# Altium schematic sheet AD7799.SchDoc
size A4; SheetNumber: 2; SheetTotal: 6
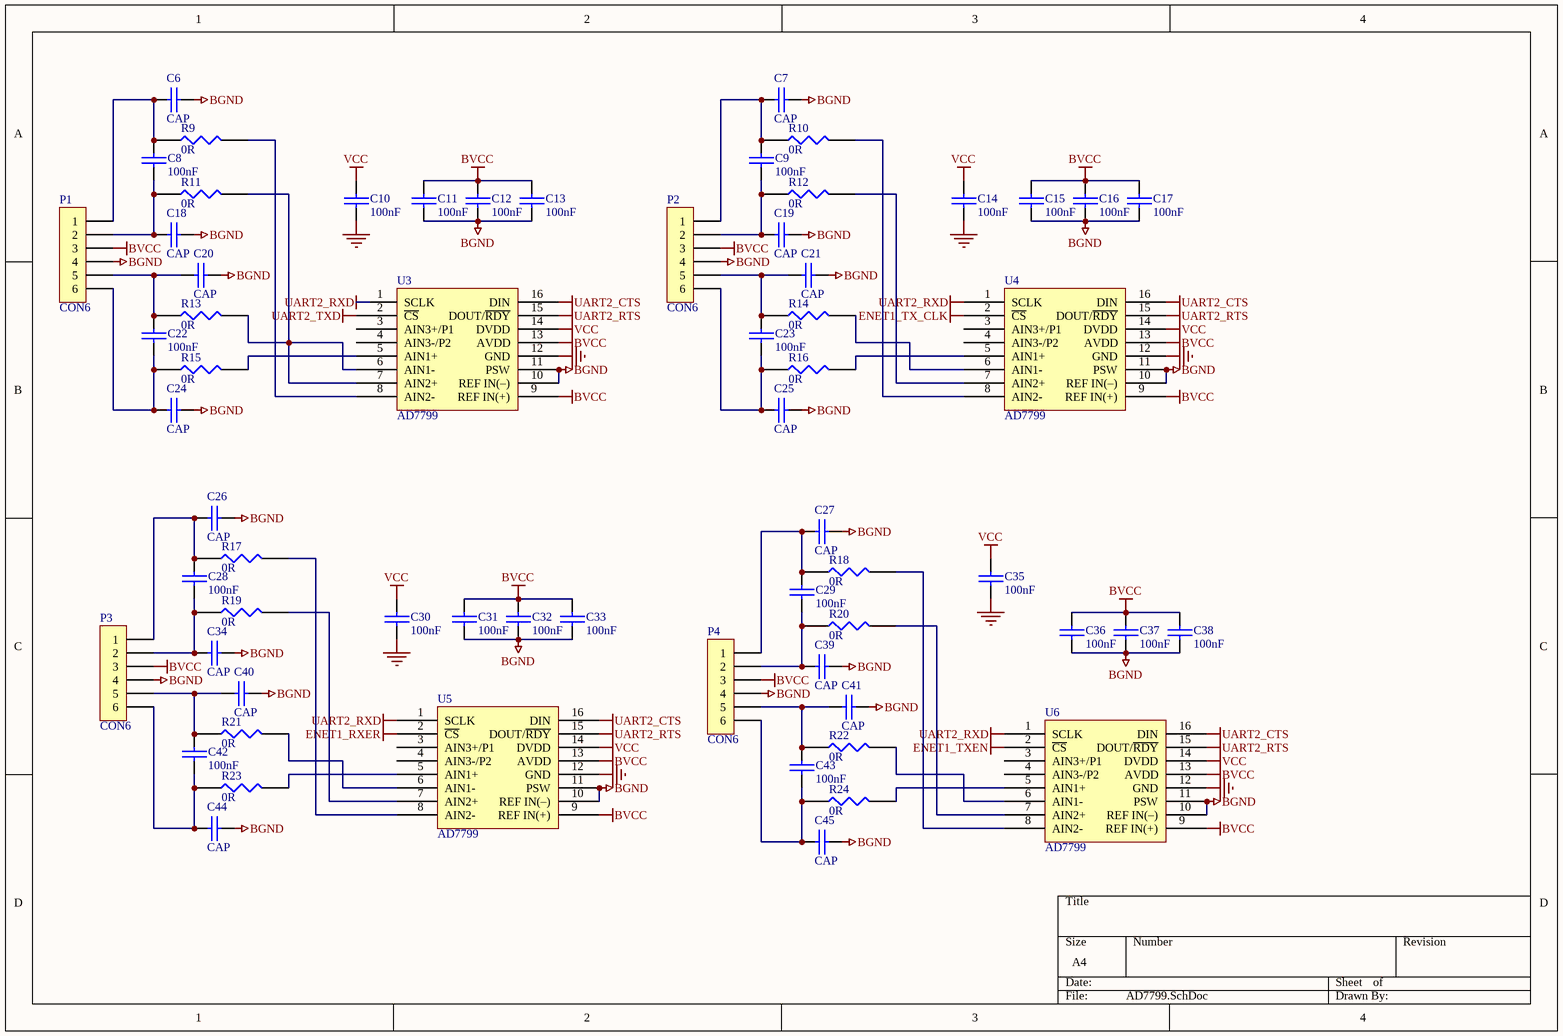
[diagram p0: AD7799.SchDoc]

## Parts
C6  CAP  [0603_C]
C7  CAP  [0603_C]
C8  100nF  [0603_C]
C9  100nF  [0603_C]
C10  100nF  [0603_C]
C11  100nF  [0603_C]
C12  100nF  [0603_C]
C13  100nF  [0603_C]
C14  100nF  [0603_C]
C15  100nF  [0603_C]
C16  100nF  [0603_C]
C17  100nF  [0603_C]
C18  CAP  [0603_C]
C19  CAP  [0603_C]
C20  CAP  [0603_C]
C21  CAP  [0603_C]
C22  100nF  [0603_C]
C23  100nF  [0603_C]
C24  CAP  [0603_C]
C25  CAP  [0603_C]
C26  CAP  [0603_C]
C27  CAP  [0603_C]
C28  100nF  [0603_C]
C29  100nF  [0603_C]
C30  100nF  [0603_C]
C31  100nF  [0603_C]
C32  100nF  [0603_C]
C33  100nF  [0603_C]
C34  CAP  [0603_C]
C35  100nF  [0603_C]
C36  100nF  [0603_C]
C37  100nF  [0603_C]
C38  100nF  [0603_C]
C39  CAP  [0603_C]
C40  CAP  [0603_C]
C41  CAP  [0603_C]
C42  100nF  [0603_C]
C43  100nF  [0603_C]
C44  CAP  [0603_C]
C45  CAP  [0603_C]
P1  CON6  [KF128-3.81-6P]
P2  CON6  [KF128-3.81-6P]
P3  CON6  [KF128-3.81-6P]
P4  CON6  [KF128-3.81-6P]
R9  0R  [0603_R]
R10  0R  [0603_R]
R11  0R  [0603_R]
R12  0R  [0603_R]
R13  0R  [0603_R]
R14  0R  [0603_R]
R15  0R  [0603_R]
R16  0R  [0603_R]
R17  0R  [0603_R]
R18  0R  [0603_R]
R19  0R  [0603_R]
R20  0R  [0603_R]
R21  0R  [0603_R]
R22  0R  [0603_R]
R23  0R  [0603_R]
R24  0R  [0603_R]
U3  AD7799  [TSSOP16]
U4  AD7799  [TSSOP16]
U5  AD7799  [TSSOP16]
U6  AD7799  [TSSOP16]

## Nets
BGND: C6.2 C7.2 C11.2 C12.2 C13.2 C15.2 C16.2 C17.2 C18.2 C19.2 C20.2 C21.2 C24.2 C25.2 C26.2 C27.2 C31.2 C32.2 C33.2 C34.2 C36.2 C37.2 C38.2 C39.2 C40.2 C41.2 C44.2 C45.2 P1.4 P2.4 P3.4 P4.4 U3.10(REF_IN(–)) U3.11(PSW) U4.10(REF_IN(–)) U4.11(PSW) U5.10(REF_IN(–)) U5.11(PSW) U6.10(REF_IN(–)) U6.11(PSW)
BVCC: C11.1 C12.1 C13.1 C15.1 C16.1 C17.1 C31.1 C32.1 C33.1 C36.1 C37.1 C38.1 P1.3 P2.3 P3.3 P4.3 U3.9(REF_IN(+)) U3.13(AVDD) U4.9(REF_IN(+)) U4.13(AVDD) U5.9(REF_IN(+)) U5.13(AVDD) U6.9(REF_IN(+)) U6.13(AVDD)
ENET1_RXER: U5.2(~{CS})
ENET1_TX_CLK: U4.2(~{CS})
ENET1_TXEN: U6.2(~{CS})
GND: C10.2 C14.2 C30.2 C35.2 U3.12(GND) U4.12(GND) U5.12(GND) U6.12(GND)
UART2_CTS: U3.16(DIN) U4.16(DIN) U5.16(DIN) U6.16(DIN)
UART2_RTS: U3.15(DOUT/~{RDY}) U4.15(DOUT/~{RDY}) U5.15(DOUT/~{RDY}) U6.15(DOUT/~{RDY})
UART2_RXD: U3.1(SCLK) U4.1(SCLK) U5.1(SCLK) U6.1(SCLK)
UART2_TXD: U3.2(~{CS})
VCC: C10.1 C14.1 C30.1 C35.1 U3.14(DVDD) U4.14(DVDD) U5.14(DVDD) U6.14(DVDD)
NetC6_1: C6.1 C8.1 P1.1 R9.1
NetC7_1: C7.1 C9.1 P2.1 R10.1
NetC8_2: C8.2 C18.1 P1.2 R11.1
NetC9_2: C9.2 C19.1 P2.2 R12.1
NetC20_1: C20.1 C22.1 P1.5 R13.1
NetC21_1: C21.1 C23.1 P2.5 R14.1
NetC22_2: C22.2 C24.1 P1.6 R15.1
NetC23_2: C23.2 C25.1 P2.6 R16.1
NetC26_1: C26.1 C28.1 P3.1 R17.1
NetC27_1: C27.1 C29.1 P4.1 R18.1
NetC28_2: C28.2 C34.1 P3.2 R19.1
NetC29_2: C29.2 C39.1 P4.2 R20.1
NetC40_1: C40.1 C42.1 P3.5 R21.1
NetC41_1: C41.1 C43.1 P4.5 R22.1
NetC42_2: C42.2 C44.1 P3.6 R23.1
NetC43_2: C43.2 C45.1 P4.6 R24.1
NetR9_2: R9.2 U3.8(AIN2-)
NetR10_2: R10.2 U4.8(AIN2-)
NetR11_2: R11.2 R13.2 U3.6(AIN1-) U3.7(AIN2+)
NetR12_2: R12.2 U4.7(AIN2+)
NetR14_2: R14.2 U4.6(AIN1-)
NetR15_2: R15.2 U3.5(AIN1+)
NetR16_2: R16.2 U4.5(AIN1+)
NetR17_2: R17.2 U5.8(AIN2-)
NetR18_2: R18.2 U6.8(AIN2-)
NetR19_2: R19.2 U5.7(AIN2+)
NetR20_2: R20.2 U6.7(AIN2+)
NetR21_2: R21.2 U5.6(AIN1-)
NetR22_2: R22.2 U6.6(AIN1-)
NetR23_2: R23.2 U5.5(AIN1+)
NetR24_2: R24.2 U6.5(AIN1+)

Not connected (* = marked no-connect by the designer): U3 3(AIN3+/P1) 4(AIN3-/P2); U4 3(AIN3+/P1) 4(AIN3-/P2); U5 3(AIN3+/P1) 4(AIN3-/P2); U6 3(AIN3+/P1) 4(AIN3-/P2)

## Library data of the parts
C6-C45 = CAP: Capacitor
P1-P4 = CON6: Connector
R9-R24 = RES1